# Altium schematic sheet FPA.SchDoc
size A3; SheetNumber: 2; SheetTotal: 3
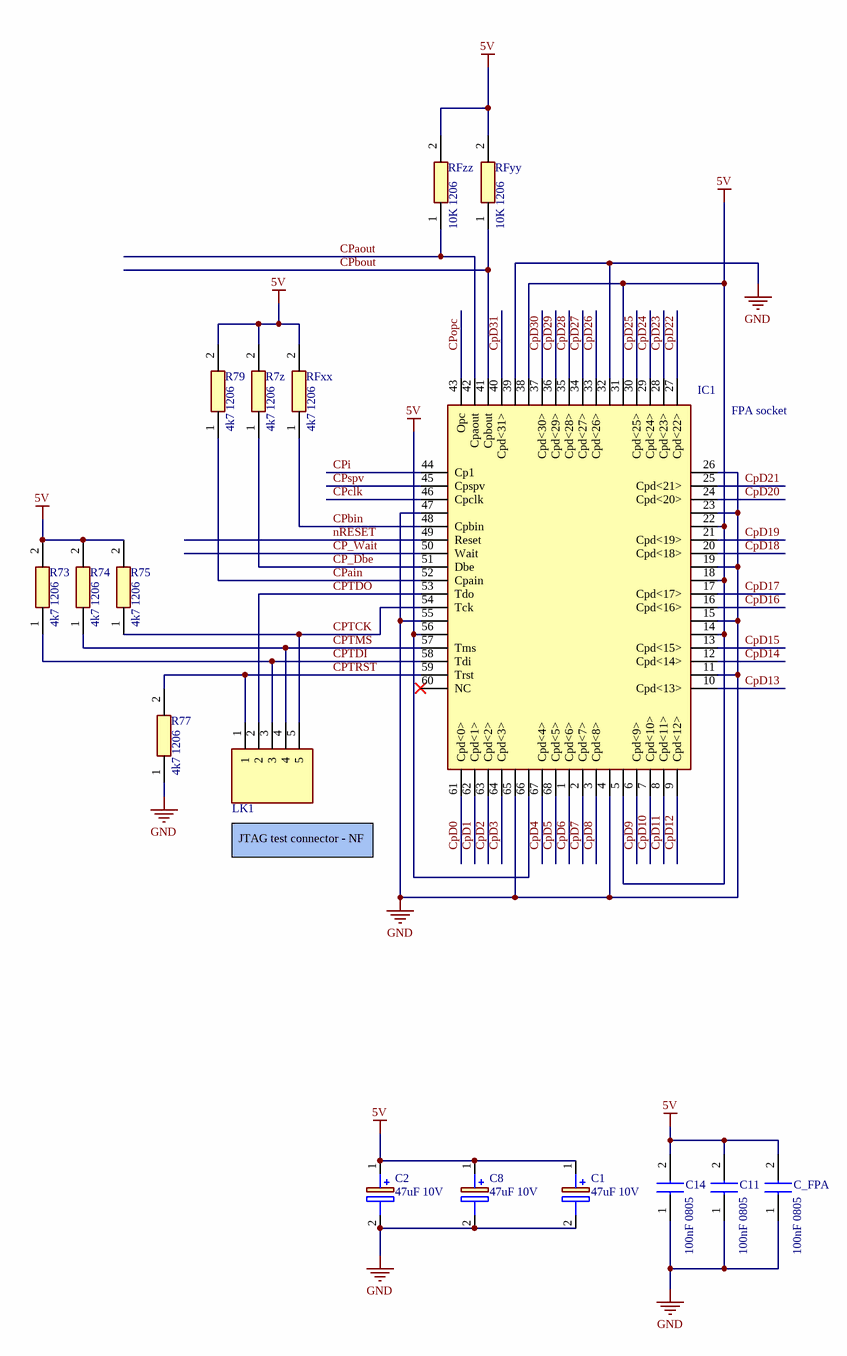
[diagram p0: FPA.SchDoc]

## Parts
C1  47uF 10V  [CAPPA3500W50L1400D525]
C2  47uF 10V  [CAPPA3500W50L1400D525]
C8  47uF 10V  [CAPPA3500W50L1400D525]
C11  100nF 0805  [CAPC2012X140N]
C14  100nF 0805  [CAPC2012X140N]
C_FPA  100nF 0805  [CAPC2012X140N]
IC1  FPA socket  [PLCC68ATx]
LK1  PREC005SAAN-RC  [HDRV5W64P0X254_1X5_1270X254X864P]  (value not drawn)
R7z  4k7 1206  [ERJ8ENF1000V]
R73  4k7 1206  [ERJ8ENF1000V]
R74  4k7 1206  [ERJ8ENF1000V]
R75  4k7 1206  [ERJ8ENF1000V]
R77  4k7 1206  [ERJ8ENF1000V]
R79  4k7 1206  [ERJ8ENF1000V]
RFxx  4k7 1206  [ERJ8ENF1000V]
RFyy  10K 1206  [ERJUP8]
RFzz  10K 1206  [ERJUP8]

## Nets
5V: C1.1(+) C2.1(+) C8.1(+) C11.2 C14.2 C_FPA.2 IC1.5 IC1.14 IC1.18 IC1.22 IC1.31 IC1.38 IC1.56 IC1.66 R7z.2 R73.2 R74.2 R75.2 R79.2 RFxx.2 RFyy.2 RFzz.2
GND: C1.2(-) C2.2(-) C8.2(-) C11.1 C14.1 C_FPA.1 IC1.4 IC1.11 IC1.15 IC1.19 IC1.23 IC1.26 IC1.32 IC1.39 IC1.47 IC1.55 IC1.65 R77.1
CP_Dbe: IC1.51(Dbe) R7z.1
CP_Wait: IC1.50(Wait)
CPain: IC1.52(Cpain) R79.1
CPaout: IC1.42(Cpaout) RFzz.1
CPbin: IC1.48(Cpbin) RFxx.1
CPbout: IC1.41(Cpbout) RFyy.1
CPclk: IC1.46(Cpclk)
CpD0: IC1.61(Cpd<0>)
CpD1: IC1.62(Cpd<1>)
CpD2: IC1.63(Cpd<2>)
CpD3: IC1.64(Cpd<3>)
CpD4: IC1.67(Cpd<4>)
CpD5: IC1.68(Cpd<5>)
CpD6: IC1.1(Cpd<6>)
CpD7: IC1.2(Cpd<7>)
CpD8: IC1.3(Cpd<8>)
CpD9: IC1.6(Cpd<9>)
CpD10: IC1.7(Cpd<10>)
CpD11: IC1.8(Cpd<11>)
CpD12: IC1.9(Cpd<12>)
CpD13: IC1.10(Cpd<13>)
CpD14: IC1.12(Cpd<14>)
CpD15: IC1.13(Cpd<15>)
CpD16: IC1.16(Cpd<16>)
CpD17: IC1.17(Cpd<17>)
CpD18: IC1.20(Cpd<18>)
CpD19: IC1.21(Cpd<19>)
CpD20: IC1.24(Cpd<20>)
CpD21: IC1.25(Cpd<21>)
CpD22: IC1.27(Cpd<22>)
CpD23: IC1.28(Cpd<23>)
CpD24: IC1.29(Cpd<24>)
CpD25: IC1.30(Cpd<25>)
CpD26: IC1.33(Cpd<26>)
CpD27: IC1.34(Cpd<27>)
CpD28: IC1.35(Cpd<28>)
CpD29: IC1.36(Cpd<29>)
CpD30: IC1.37(Cpd<30>)
CpD31: IC1.40(Cpd<31>)
CPi: IC1.44(Cp1)
CPopc: IC1.43(Opc)
CPspv: IC1.45(Cpspv)
CPTCK: IC1.54(Tck) LK1.5 R75.1
CPTDI: IC1.58(Tdi) LK1.3 R73.1
CPTDO: IC1.53(Tdo) LK1.2
CPTMS: IC1.57(Tms) LK1.4 R74.1
CPTRST: IC1.59(Trst) LK1.1 R77.2
nRESET: IC1.49(Reset)

Not connected (* = marked no-connect by the designer): IC1 60(NC)*

## Notes on the sheet
- JTAG test connector - NF
- SIZE
- DIMENSIONS
- TITLE
- VARIANT
- REVISION
- DATE
- A3
- SHEET
- OF
- FILE
- DRAWN BY

## Library data of the parts
C1 C2 C8 = 226TTA035MSD: Capacitor Polarised; Manufacturer_Name: Cornell Dubilier; Datasheet Link: https://www.cde.com/resources/catalogs/TTA.pdf; Manufacturer_Part_Number: 226TTA035MSD; Mouser Part Number: 598-226TTA035MSD; Mouser Price/Stock: https://www.mouser.co.uk/ProductDetail/Cornell-Dubilier-CDE/226TTA035MSD?qs=BLH6sjKQk%252BnmuwhdB%252B0F9g%3D%3D
C11 C14 C_FPA = C0805C104J4JACAUTO: Capacitor; Manufacturer_Name: KEMET; Datasheet Link: https://content.kemet.com/datasheets/KEM_C1091_C0G_ESD.pdf; Height: 1.4mm; Manufacturer_Part_Number: C0805C104J4JACAUTO; Mouser Part Number: 80-C0805C104J4JAUTO; Mouser Price/Stock: https://www.mouser.co.uk/ProductDetail/KEMET/C0805C104J4JACAUTO?qs=MyNHzdoqoQKNICuQqAIXfA%3D%3D; Arrow Part Number: C0805C104J4JACAUTO; Arrow Price/Stock: https://www.arrow.com/en/products/c0805c104j4jacauto/kemet-corporation?region=nac
IC1 = FPA_SKT_THT: Manufacturer_Name: 3M; Manufacturer_Part_Number: 8468-21B1-RK-TR; Datasheet Link: https://www.arrow.com/en/products/8468-21b1-rk-tr/3m; Height: 4.6mm; Mouser Part Number: 517-8468-21B1-RK-TR; Mouser Price/Stock: https://www.mouser.co.uk/ProductDetail/3M-Electronic-Solutions-Division/8468-21B1-RK-TR?qs=X%2F%2F06fXhnJ18zOj3KK47CQ%3D%3D; Arrow Part Number: 8468-21B1-RK-TR; Arrow Price/Stock: https://www.arrow.com/en/products/8468-21b1-rk-tr/3m
LK1 = PREC005SAAN-RC: Connector; Manufacturer_Name: Sullins; Datasheet Link: https://media.digikey.com/PDF/Data%20Sheets/Sullins%20PDFs/z%20RzCzzzSzzN-RC,%20ST,11635-B.pdf; Height: 8.64mm; Manufacturer_Part_Number: PREC005SAAN-RC
R7z R73-R75 R77 R79 RFxx = ERJ-8ENF4701V: Resistor; Manufacturer_Name: Panasonic; Datasheet Link: https://industrial.panasonic.com/cdbs/www-data/pdf/RDA0000/AOA0000C86.pdf; Height: 0.7mm; Manufacturer_Part_Number: ERJ-8ENF4701V; Mouser Part Number: 667-ERJ-8ENF4701V; Mouser Price/Stock: https://www.mouser.co.uk/ProductDetail/Panasonic/ERJ-8ENF4701V?qs=8%252BG0TiN%2FgVpQwzrqnqT%252BJA%3D%3D; Arrow Part Number: ERJ-8ENF4701V; Arrow Price/Stock: https://www.arrow.com/en/products/erj-8enf4701v/panasonic
RFyy RFzz = ERJ-UP8D1002V: Resistor; Manufacturer_Name: Panasonic; Datasheet Link: https://industrial.panasonic.com/cdbs/www-data/pdf/RDP0000/AOA0000C337.pdf; Height: 0.7mm; Manufacturer_Part_Number: ERJ-UP8D1002V